# Altium schematic sheet inhibits2.SchDoc
size 297 x 209 mm
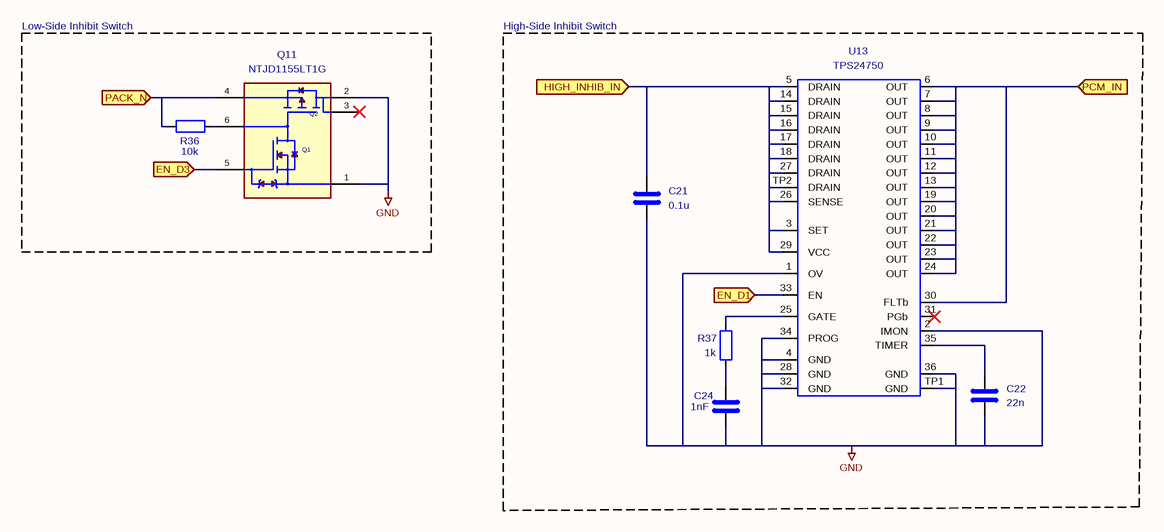
[diagram p0: inhibits2.SchDoc]

## Parts
C21  0.1u  [C_0402_1005Metric]
C22  22n  [C_0402_1005Metric]
C24  1nF  [C_0402_1005Metric]
Q11  NTJD1155LT1G  [TRANS_NTJD1155LT1G]
R36  10k  [R_0402_1005Metric]
R37  1k  [R_0402_1005Metric]
U13  TPS24750  [TPS24750]

## Blocks framed on the sheet
Low-Side Inhibit Switch /: Q11 R36
High-Side Inhibit Switch /: C21 C22 C24 R37 U13

## Ports
EN_D1 (in), EN_D3 (in), HIGH_INHIB_IN (in), PACK_N (in), PCM_IN (in)

## Nets
GND: C21.2 C22.2 C24.2 Q11.1 Q11.2 U13.1(OV) U13.2(IMON) U13.4(GND) U13.28(GND) U13.32(GND) U13.34(PROG) U13.36(GND) U13.TP1(GND)
EN_D1: U13.33(EN) ; port EN_D1
EN_D3: Q11.5 ; port EN_D3
HIGH_INHIB_IN: C21.1 U13.3(SET) U13.5(DRAIN) U13.14(DRAIN) U13.15(DRAIN) U13.16(DRAIN) U13.17(DRAIN) U13.18(DRAIN) U13.26(SENSE) U13.27(DRAIN) U13.29(VCC) U13.TP2(DRAIN) ; port HIGH_INHIB_IN
PACK_N: Q11.4 R36.1 ; port PACK_N
PCM_IN: U13.6(OUT) U13.7(OUT) U13.8(OUT) U13.9(OUT) U13.10(OUT) U13.11(OUT) U13.12(OUT) U13.13(OUT) U13.19(OUT) U13.20(OUT) U13.21(OUT) U13.22(OUT) U13.23(OUT) U13.24(OUT) U13.30(FLTb) ; port PCM_IN
NetC22_1: C22.1 U13.35(TIMER)
NetC24_1: C24.1 R37.2
NetQ11_6: Q11.6 R36.2
NetR37_1: R37.1 U13.25(GATE)

Not connected (* = marked no-connect by the designer): Q11 3*; U13 31(PGb)*

## Notes on the sheet
- 1
- 2
- 3
- 4
- 5
- 6
- A
- B
- C
- D
- Title:
- File: inhibits2.kicad_sch
- Sheet: /
- KiCad E.D.A.  kicad (5.1.4)-1
- Size: A4
- Date:
- Rev:
- Id: 1/1
- (in symbol NTJD1155LT1G) Q2; Q1

## Library data of the parts
C21 C22 C24 = C: Footprint: Capacitor_SMD:C_0402_1005Metric
  C21: Value: 0.1u
  C22: Value: 22n
  C24: Value: 1nF
Q11 = NTJD1155LT1G: MANUFACTURER: ON Semiconductor; PARTREV: Rev. 6; STANDARD: Manufacturer recommendations; MAXIMUM_PACKAGE_HEIGHT: 1.1mm; Value: NTJD1155LT1G; Footprint: qset-footprints:TRANS_NTJD1155LT1G
R36 R37 = R: Footprint: Resistor_SMD:R_0402_1005Metric
  R36: Value: 10k
  R37: Value: 1k
U13 = TPS24750: Value: TPS24750; Footprint: qset-footprints:TPS24750